# EAGLE design JoystickWing (EAGLE 9.6.2)
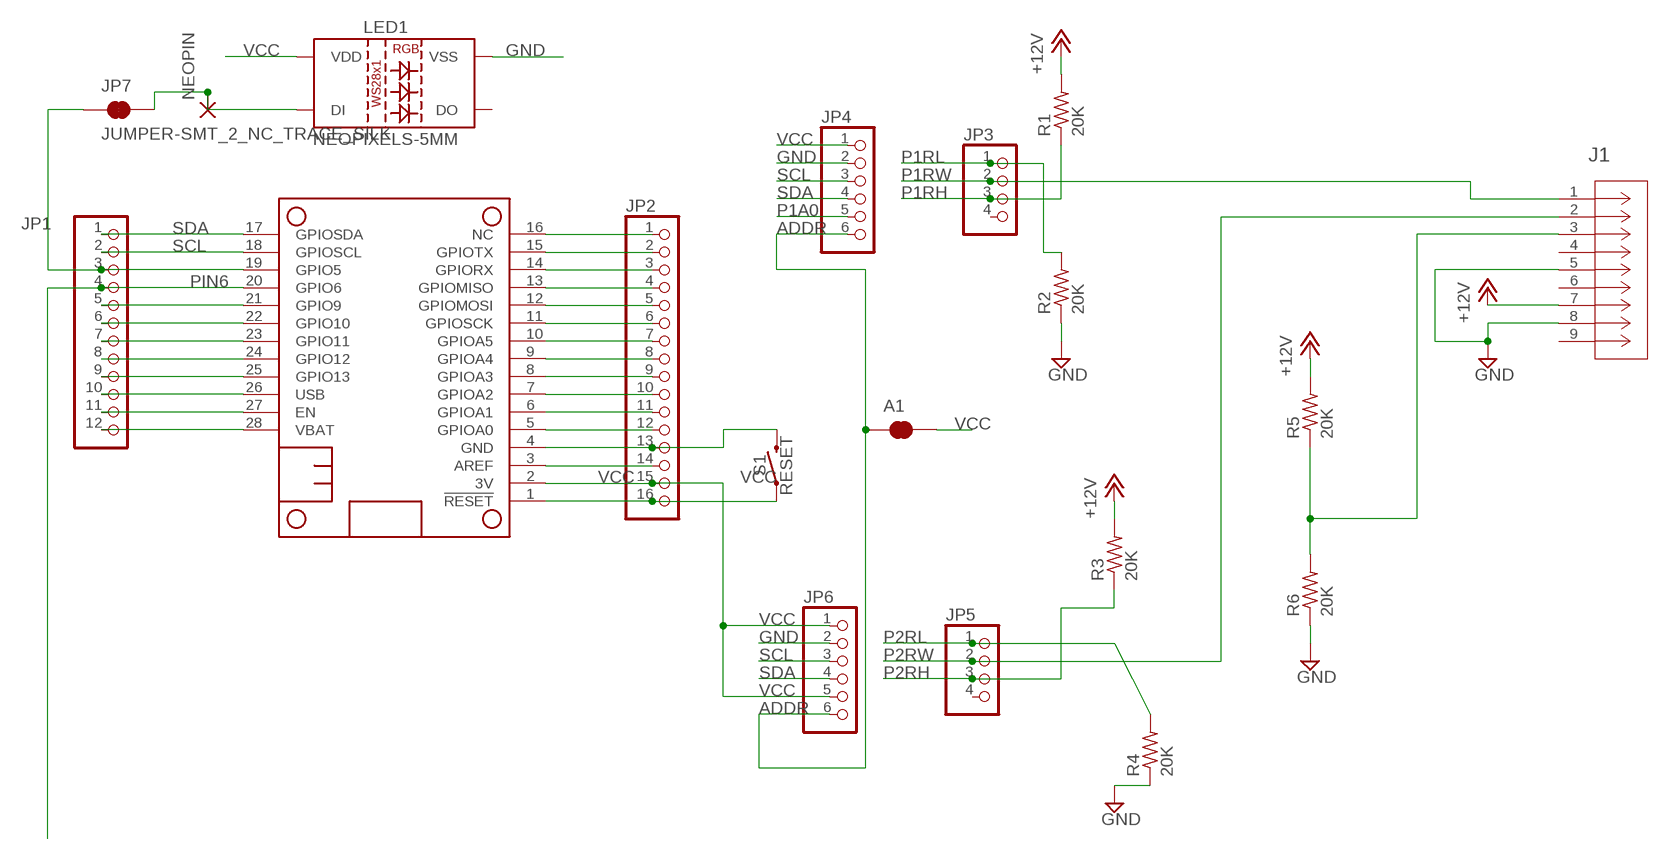
[diagram p0: schematic, sheet 1]

## Parts
A1  JUMPER-SMT_2_NC_TRACE_SILK  [SMT-JUMPER_2_NC_TRACE_SILK]
J1  5747844-4  [CONN_5747844-4]
JP1  PINHD-1X12  [1X12]
JP2  PINHD-1X16  [1X16]
JP3  HEADER-1X4ROUND  [1X04_ROUND]
JP4  HEADER-1X6ROUND  [1X06_ROUND]
JP5  HEADER-1X4ROUND  [1X04_ROUND]
JP6  HEADER-1X6ROUND  [1X06_ROUND]
JP7  JUMPER-SMT_2_NC_TRACE_SILK  [SMT-JUMPER_2_NC_TRACE_SILK]
LED1  NEOPIXELS-5MM  [NEOPIXELS-5MM]
MS1  FEATHERWING_NODIM  [FEATHERWING_DIM]
NEOPIN  2,54/1,1  [2,54/1,1]
R1  20K  R-US_0204/7  [0204/7]
R2  20K  R-US_0204/7  [0204/7]
R3  20K  R-US_0204/7  [0204/7]
R4  20K  R-US_0204/7  [0204/7]
R5  20K  R-US_0204/7  [0204/7]
R6  20K  R-US_0204/7  [0204/7]
S1  RESET  SWITCH_DTS-3  [DTS-3]

## Nets
+12V: J1.7 R1.2 R3.2 R5.2
ADDR: A1.1 JP4.6 JP6.6
GND: J1.5 J1.8 JP2.13 JP4.2 JP6.2 LED1.P3(VSS) MS1.4(GND) R2.1 R4.1 R6.1 S1.2
N$1: JP1.3 JP7.1 MS1.19(GPIO5)
N$3: JP1.5 MS1.21(GPIO9)
N$4: JP1.6 MS1.22(GPIO10)
N$5: JP1.7 MS1.23(GPIO11)
N$6: JP1.8 MS1.24(GPIO12)
N$7: J1.3 R5.1 R6.2
N$8: JP1.9 MS1.25(GPIO13)
N$9: JP1.11 MS1.27(EN)
N$10: JP2.1 MS1.16(NC)
N$11: JP2.2 MS1.15(GPIOTX)
N$12: JP2.3 MS1.14(GPIORX)
N$13: JP2.4 MS1.13(GPIOMISO)
N$14: JP2.5 MS1.12(GPIOMOSI)
N$15: JP2.6 MS1.11(GPIOSCK)
N$16: JP2.7 MS1.10(GPIOA5)
N$17: JP2.8 MS1.9(GPIOA4)
N$18: JP2.9 MS1.8(GPIOA3)
N$19: JP2.10 MS1.7(GPIOA2)
N$20: JP2.11 MS1.6(GPIOA1)
N$21: JP2.12 MS1.5(GPIOA0)
N$23: JP2.14 MS1.3(AREF)
N$24: JP2.16 MS1.1(!RESET) S1.1
N$25: JP7.2 LED1.P1(DI) NEOPIN.1(P)
P1A0: JP4.5
P1RH: JP3.3 R1.1
P1RL: JP3.1 R2.2
P1RW: J1.1 JP3.2
P2RH: JP5.3 R3.1
P2RL: JP5.1 R4.2
P2RW: J1.2 JP5.2
PIN6: JP1.4 MS1.20(GPIO6)
SCL: JP1.2 JP4.3 JP6.3 MS1.18(GPIOSCL)
SDA: JP1.1 JP4.4 JP6.4 MS1.17(GPIOSDA)
USB: JP1.10 MS1.26(USB)
VBAT: JP1.12 MS1.28(VBAT)
VCC: A1.2 JP2.15 JP4.1 JP6.1 JP6.5 LED1.P2(VDD) MS1.2(3V)
Unconnected: J1.4 J1.6 J1.9 JP3.4 JP5.4 LED1.P4(DO)

## Library data of the parts
A1 JP7 = SparkFun-Jumpers:JUMPER-SMT_2_NC_TRACE: Normally closed trace jumper This jumper has a trace between two pads so it's normally closed (NC). Use a razor knife to open the connection. For best results follow the IPC guidelines for cutting traces: Cutout at least 0.063 mm (0.005 in). Remove all loose material to clean up the cut area. Seal the cut with an approved epoxy. Reapply solder to reclose the connection.
J1 = DSub9:5747844-4: D-Sub 8 Serial Port; MANUFACTURER_PART_NUMBER: 57478444; VENDOR: TE Connectivity
JP1 = adafruit:PINHD-1X12: PIN HEADER
JP2 = pinhead:PINHD-1X16: PIN HEADER
JP3 JP5 = microbuilder:HEADER-1X4: PIN HEADER
JP4 JP6 = microbuilder:HEADER-1X6: PIN HEADER
LED1 = milador:NEOPIXELS-5MM: WS2812B PTH addressable RGB LED 5mm PTH LED with built-in controller IC. Color: Red/Green/Blue mC Rating: RGB: 390, 660, 180 mcd Forward Voltage: RGB: 2.0, 3.0, 3.0 V SparkFun Products: LED - RGB Addressable, PTH, 5mm Diffused (5 Pack) <https://www.sparkfun.com/products/12986> LED - RGB Addressable, PTH, 5mm Clear (5 Pack) <https://www.sparkfun.com/products/12999> Datasheet referenced for footprint: WS2812B-PTH <https://cdn.sparkfun.com/datasheets/Components/LED/COM-12877.pdf>
MS1 = adafruit:FEATHERWING
NEOPIN = wirepad:2,54/1,1: THROUGH-HOLE PAD
R1-R6 = adafruit:R-US_: RESISTOR, American symbol
S1 = milador:SWITCH_DTS-3

## Board
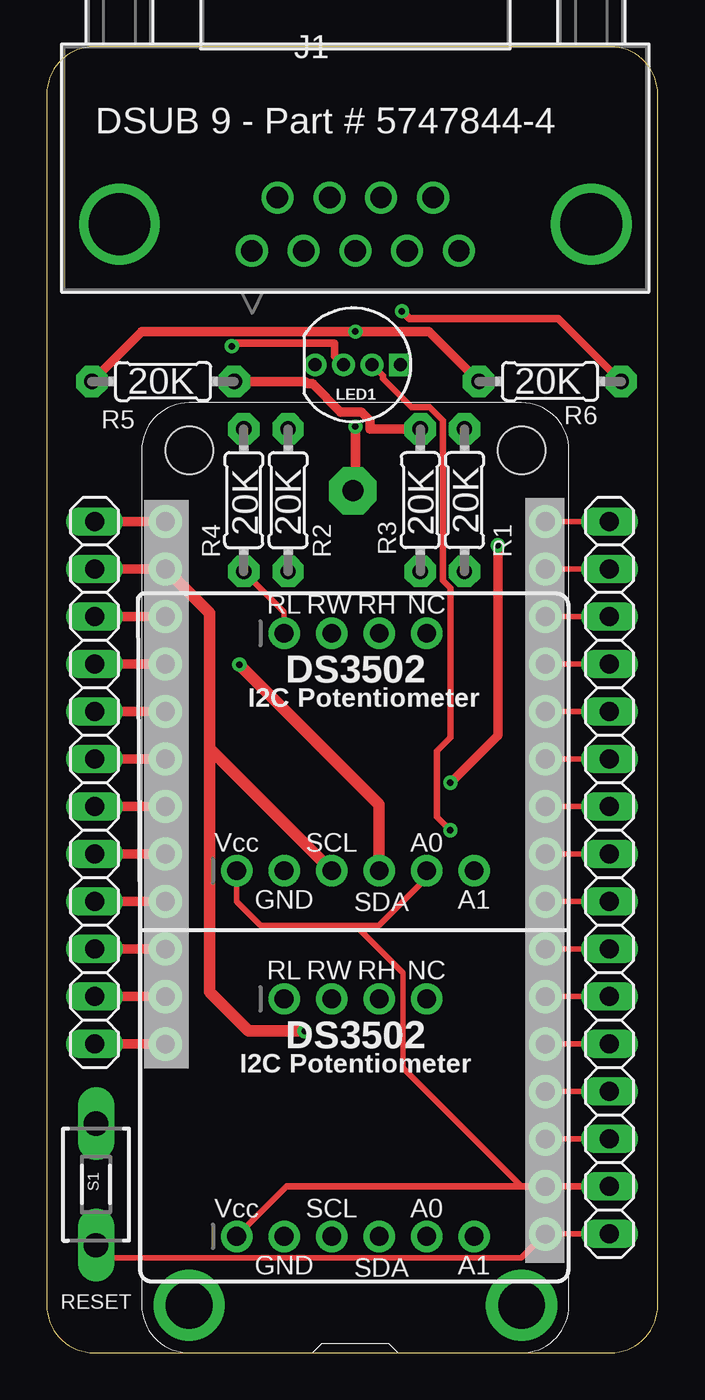
[diagram p1: board, top side]
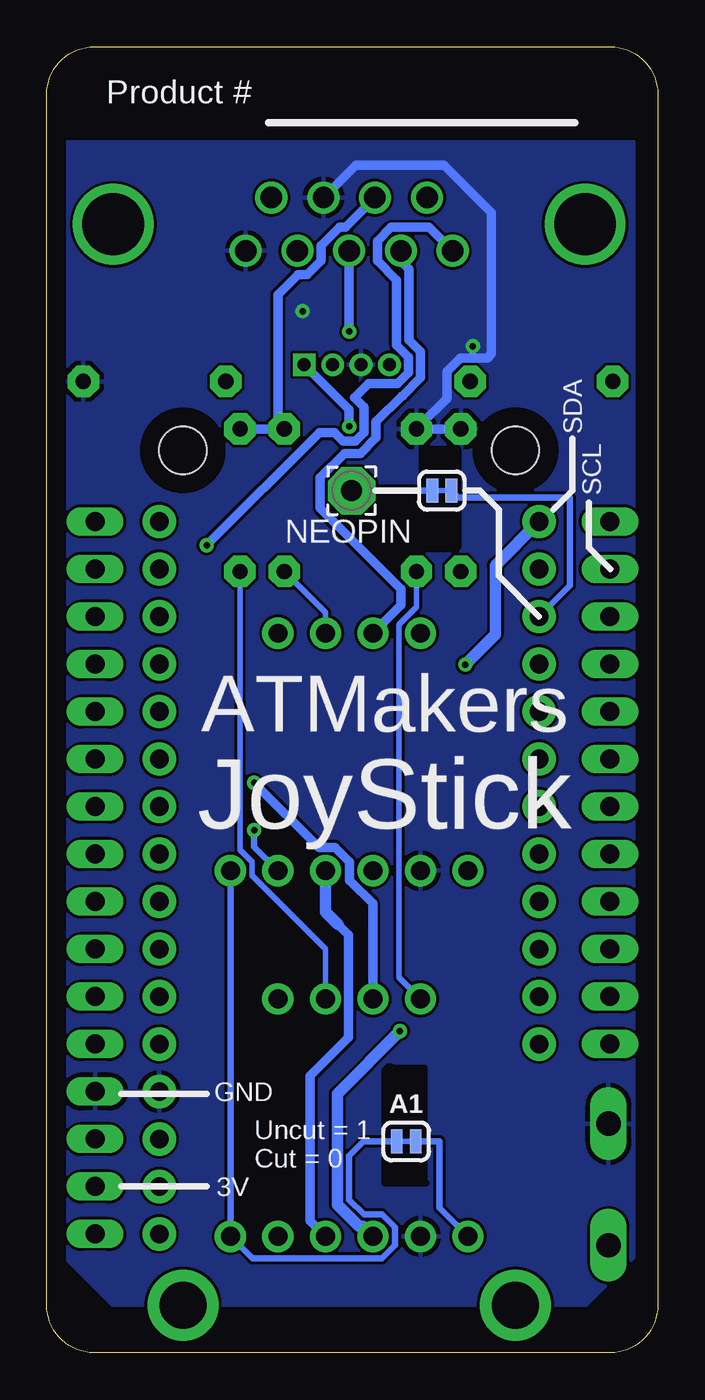
[diagram p2: board, bottom side, seen from below]

Size 32.69 x 69.84 mm. Coordinates in mm from the lower left corner, seen from the top.
Outline: 0,67.3 0,2.54 arc90 2.54,0 30.15,0 arc90 32.69,2.54 32.69,67.3 arc90 30.15,69.84 2.54,69.84 arc90 0,67.3
Copper layers (1*16): Top 0.035mm / dielectric 1.5mm / Bottom 0.035mm
Design rules "default *": minimum track width 6mil, minimum drill 0.35mm, track to track 6mil, track to pad 6mil, pad to pad 6mil, via to via 6mil, smd to smd 6mil, copper to edge 40mil, drill to drill 6mil, minimum pad ring 10mil, minimum via ring 8mil, stop-mask expansion 4mil, vias tented up to drill 20mil, thermal gap 10mil
bRestrict: area 12.4,9.1 to 14.6,15.3; area 10.7,43 to 12.6,48.3

### Footprints (pad centres in the part's own frame; a part is rotated, then mirrored left to right if it is on the bottom)
SMT-JUMPER_2_NC_TRACE_SILK = smd 0.635 x 1.27: 1 -0.508,0; 2 0.508,0
CONN_5747844-4 = drill 1.143 pad 1.651: 1 -5.537,-10.922; 2 -2.769,-10.922; 3 0,-10.922; 4 2.769,-10.922; 5 5.537,-10.922; 6 -4.166,-8.077; 7 -1.372,-8.077; 8 1.372,-8.077; 9 4.166,-8.077 | drill 3.302 pad 3.302: 10 -12.624,-9.5; 11 12.624,-9.5
1X12 = drill 1.016 long: 1 -13.97,0; 2 -11.43,0; 3 -8.89,0; 4 -6.35,0; 5 -3.81,0; 6 -1.27,0; 7 1.27,0; 8 3.81,0; 9 6.35,0; 10 8.89,0; 11 11.43,0; 12 13.97,0
1X16 = drill 1.016 long: 1 -19.05,0; 2 -16.51,0; 3 -13.97,0; 4 -11.43,0; 5 -8.89,0; 6 -6.35,0; 7 -3.81,0; 8 -1.27,0; 9 1.27,0; 10 3.81,0; 11 6.35,0; 12 8.89,0; 13 11.43,0; 14 13.97,0; 15 16.51,0; 16 19.05,0
1X04_ROUND = drill 1 pad 1.676: 1 -3.81,0; 2 -1.27,0; 3 1.27,0; 4 3.81,0
1X06_ROUND = drill 1 pad 1.676: 1 -6.35,0; 2 -3.81,0; 3 -1.27,0; 4 1.27,0; 5 3.81,0; 6 6.35,0
NEOPIXELS-5MM = drill 0.7 pad 1.016 square: P1 2.28,0 | drill 0.7 pad 1.016: P2 0.76,0; P3 -0.76,0; P4 -2.28,0
FEATHERWING_DIM = drill 1 pad 1.778: 1 6.35,1.27; 2 8.89,1.27; 3 11.43,1.27; 4 13.97,1.27; 5 16.51,1.27; 6 19.05,1.27; 7 21.59,1.27; 8 24.13,1.27; 9 26.67,1.27; 10 29.21,1.27; 11 31.75,1.27; 12 34.29,1.27; 13 36.83,1.27; 14 39.37,1.27; 15 41.91,1.27; 16 44.45,1.27; 17 44.45,21.59; 18 41.91,21.59; 19 39.37,21.59; 20 36.83,21.59; 21 34.29,21.59; 22 31.75,21.59; 23 29.21,21.59; 24 26.67,21.59; 25 24.13,21.59; 26 21.59,21.59; 27 19.05,21.59; 28 16.51,21.59 | drill 2.5 pad 3.81: P$1 2.54,20.32; P$2 2.54,2.54 | hole 2.54: 48.26,20.32; 48.26,2.54
2,54/1,1 = drill 1.118 pad 2.54 octagon: 1 0,0
0204/7 = drill 0.813 pad 1.676 octagon: 1 -3.81,0; 2 3.81,0
DTS-3 = drill 1.3 long: 1 -3.25,0; 2 3.25,0

### Placement (x,y rotation side)
A1  13.46,11.3 0 bottom
J1  16.51,69.85 0 top
JP1  2.56,30.48 270 top
JP2  30.1,25.4 270 top
JP3  16.51,18.92 0 top
JP4  16.51,6.22 0 top
JP5  16.51,38.48 0 top
JP6  16.51,25.78 0 top
JP7  11.56,46.1 180 bottom
LED1  16.64,52.83 0 top
MS1  27.94,0 90 top
NEOPIN  16.38,46.1 90 bottom
R1  22.35,45.59 90 top
R2  12.91,45.59 270 top
R3  19.98,45.59 90 top
R4  10.54,45.59 270 top
R5  6.22,51.94 0 top
R6  26.92,51.94 180 top
S1  2.64,9 90 top

### Tracks (layer width: path | path; a pad name or v marks a point on that pad's centre or on a via)
+12V
  Top 0.508: R5.2 13.82,51.94 13.94,51.82 14.22,51.82 15.72,50.31 16.84,50.31 17.3,49.85 17.3,49.4 R3.2
  Bottom 0.508: J1.7 16.72,60.19 17.03,60.19 18.02,59.21 18.02,58.41 18.75,57.66 19.25,57.66 20.32,56.59 20.32,49.74 R3.2 R1.2
ADDR
  Bottom 0.356: A1.1 14.07,11.2 14.07,11.23 13.99,11.3 15.75,11.3 16.51,10.54 16.51,8.18 15.72,7.39 14.76,7.39 14.07,6.71 14.07,5.74 14.76,5.05 21.69,5.05 JP4.6 JP6.6
GND  (via drill 0.35)
  Top 0.305: MS1.4 JP2.13
  Top 0.406: LED1.P3 15.4,53.31 15.4,54 10.07,54 v9.9,53.83 | R6.1 27.38,55.3 19.4,55.3 v19,55.7
  Bottom 0.406: v9.9,53.83 9.9,53.19
  Bottom 0.508: R2.1 12.74,49.57 | 12.74,49.57 11.28,51.04 11.28,52.46 10.55,53.19 9.9,53.19 9.13,53.19 8.89,53.42 8.89,60.96 11.43,63.5 16.15,63.5 J1.8 | R4.1 12.57,49.4 12.74,49.57
  pour Bottom: 1.27,64.77 31.75,64.77 31.75,5.08 29.21,2.54 3.81,2.54 1.27,5.08
N$1
  Top 0.508: JP1.3 MS1.19
  Bottom 0.356: JP7.1 10.67,45.72 4.7,45.72 4.7,41.02 MS1.19
N$3
  Top 0.508: JP1.5 MS1.21
N$4
  Top 0.508: JP1.6 MS1.22
N$5
  Top 0.508: JP1.7 MS1.23
N$6
  Top 0.508: JP1.8 MS1.24
N$7  (via drill 0.35)
  Top 0.508: R6.2 20.45,54.61 v16.51,54.61 5.08,54.61 R5.1
  Bottom 0.508: J1.3 v16.51,54.61
N$8
  Top 0.508: JP1.9 MS1.25
N$9
  Top 0.508: JP1.11 MS1.27
N$10
  Top 0.305: MS1.16 JP2.1
N$11
  Top 0.305: MS1.15 JP2.2
N$12
  Top 0.305: MS1.14 JP2.3
N$13
  Top 0.305: MS1.13 JP2.4
N$14
  Top 0.305: MS1.12 JP2.5
N$15
  Top 0.305: MS1.11 JP2.6
N$16
  Top 0.305: MS1.10 JP2.7
N$17
  Top 0.305: MS1.9 JP2.8
N$18
  Top 0.305: MS1.8 JP2.9
N$19
  Top 0.305: MS1.7 JP2.10
N$20
  Top 0.305: MS1.6 JP2.11
N$21
  Top 0.305: MS1.5 JP2.12
N$23
  Top 0.305: MS1.3 JP2.14
N$24
  Top 0.305: JP2.16 MS1.1 25.4,5.08 3.31,5.08 S1.1
N$25  (via drill 0.35)
  Top 0.508: v16.51,49.53 16.51,46.23 NEOPIN.1
  Bottom 0.356: JP7.2 NEOPIN.1
  Bottom 0.508: LED1.P1 16.51,50.42 v16.51,49.53
P1RH
  Bottom 0.305: R1.1 22.35,26.89 21.72,26.25 21.72,25.53 17.78,21.59 JP3.3
P1RL
  Bottom 0.305: R2.2 12.91,39.89 13.84,38.95 13.84,20.07 JP3.1
P1RW  (via drill 0.35)
  Top 0.508: v21.59,30.48 24.13,33.02 v24.13,43.18
  Bottom 0.508: v21.59,30.48 18.14,27.03 17.26,27.03 16.48,26.25 16.48,25.27 15.24,24.02 JP3.2 | J1.1 12.24,60.19 14.27,60.19 15.01,59.45 15.01,58.41 13.97,57.37 13.97,53.87 13.35,53.25 13.35,52.41 13.94,51.82 15.49,51.82 16.23,51.08 15.72,50.57 15.72,49.2 16.18,48.74 16.84,48.74 17.3,49.2 18.11,49.2 v24.13,43.18
P2RH
  Bottom 0.305: R3.1 17.78,39.58 JP5.3
P2RL
  Top 0.305: R4.2 12.7,39.62 JP5.1
P2RW
  Bottom 0.508: JP5.2 13.74,39.98 13.74,40.85 18.06,45.17 18.06,46.8 16.77,48.09 15.91,48.09 15.06,48.93 15.06,49.79 13.69,51.16 13.66,51.16 12.69,52.14 12.69,53.52 13.31,54.15 13.31,57.94 13.74,58.37 J1.2
PIN6
  Top 0.508: JP1.4 MS1.20
SCL  (via drill 0.35)
  Top 0.508: JP1.2 MS1.18
  Top 0.61: MS1.18 8.7,39.56 8.7,32.32 | 8.7,32.32 JP6.3 | v13.8,17.2 10.8,17.2 8.7,19.3 8.7,32.32
  Bottom 0.61: JP4.3 15.77,6.76 15.99,6.76 17.14,7.91 17.14,13.86 v13.8,17.2
SDA  (via drill 0.35)
  Top 0.508: JP1.1 MS1.17
  Top 0.61: v10.3,36.8 17.78,29.32 JP6.4
  Bottom 0.508: 17.1,22.9 16.54,22.34 16.54,16.86 18.6,14.8 18.6,7.04 JP4.4
  Bottom 0.61: MS1.17 8.7,42.1 8.7,38.4 v10.3,36.8 | JP6.4 17.78,23.58 17.1,22.9
USB
  Top 0.508: JP1.10 MS1.26
VBAT
  Top 0.508: JP1.12 MS1.28
VCC  (via drill 0.35)
  Top 0.305: JP6.1 10.16,24.13 11.43,22.86 16.51,22.86 | 16.51,22.86 17.78,22.86 20.32,25.4 JP6.5 | 16.51,22.86 19.05,20.32 19.05,15.24 25.4,8.89 | JP4.1 12.83,8.89
  Top 0.356: LED1.P2 17.98,52.25 17.98,52.09 19.5,50.57 20.46,50.57 21.18,49.85 21.18,41.3 21.59,40.89 21.59,32.89 20.88,32.19 20.88,28.65 v21.59,27.94 | JP2.15 MS1.2 25.4,8.89 12.83,8.89
  Bottom 0.356: v21.59,27.94 21.59,27.05 JP6.5 | JP4.1 11.68,7.75 11.68,11.3 A1.2

### Text on the board
tPlace: DSUB 9 - Part # 5747844-4 | 20K | 20K | 20K | 20K | 20K | 20K | RL | RW | RH | NC | DS3502 | I2C Potentiometer | Vcc | SCL | A0 | GND | SDA | A1 | RL | RW | RH | NC | DS3502 | I2C Potentiometer | Vcc | SCL | A0 | GND | SDA | A1
bPlace: Product # | SDA | SCL | ATMakers | JoyStick | GND | Uncut = 1 / Cut = 0 | 3V